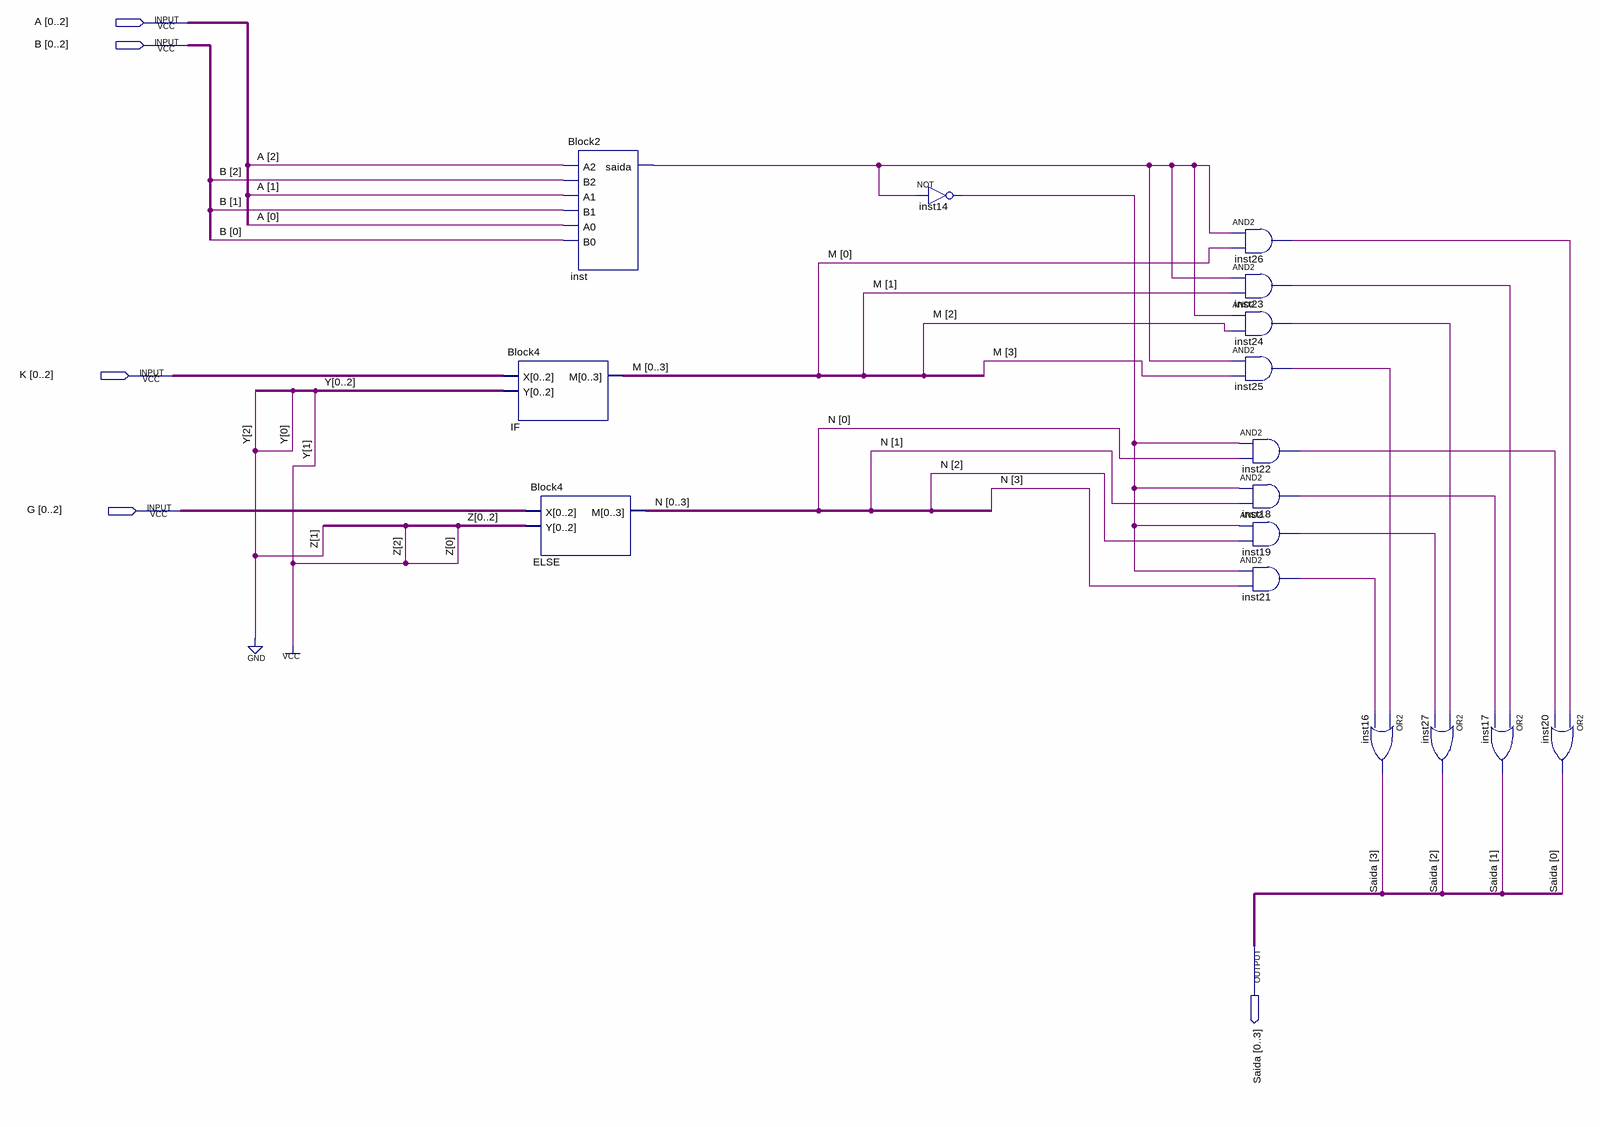
[diagram p0: schematic sheet]
// Quartus schematic projeto.bdf as structural Verilog: 16 symbols, 5 pins
module projeto (
  input  [0:2] A,
  input  [0:2] B,
  input  [0:2] K,
  input  [0:2] G,
  output [0:3] Saida
);

  wire inst14_out, inst18_out, inst19_out, inst21_out, inst22_out, inst23_out, inst24_out, inst25_out,
       inst26_out, inst_saida;
  wire [3:0] M, N;

  Block4 IF (.X(K), .Y(3'b010), .M({M[0], M[1], M[2], M[3]}));
  Block2 inst (.A2(A[2]), .B2(B[2]), .A1(A[1]), .B1(B[1]), .A0(A[0]), .B0(B[0]), .saida(inst_saida));
  Block4 ELSE (.X(G), .Y(3'b101), .M({N[0], N[1], N[2], N[3]}));
  not inst14 (inst14_out, inst_saida);
  and inst26 (inst26_out, inst_saida, M[0]);
  and inst23 (inst23_out, inst_saida, M[1]);
  and inst24 (inst24_out, inst_saida, M[2]);
  and inst25 (inst25_out, inst_saida, M[3]);
  and inst22 (inst22_out, inst14_out, N[0]);
  and inst18 (inst18_out, inst14_out, N[1]);
  and inst19 (inst19_out, inst14_out, N[2]);
  and inst21 (inst21_out, inst14_out, N[3]);
  or inst16 (Saida[3], inst25_out, inst21_out);
  or inst27 (Saida[2], inst24_out, inst19_out);
  or inst17 (Saida[1], inst23_out, inst18_out);
  or inst20 (Saida[0], inst26_out, inst22_out);
endmodule
